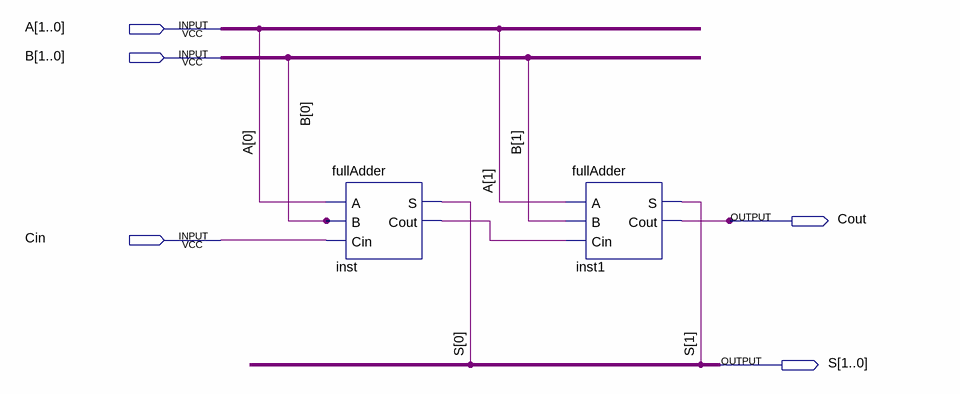
[diagram p0: schematic sheet]
// Quartus schematic 2bitAdder.bdf as structural Verilog: 2 symbols, 5 pins
module \2bitAdder  (
  input  [1:0] A,
  input  [1:0] B,
  input  Cin,
  output Cout,
  output [1:0] S
);

  wire inst_cout;

  fullAdder inst (.A(A[0]), .B(B[0]), .Cin(Cin), .S(S[0]), .Cout(inst_cout));
  fullAdder inst1 (.A(A[1]), .B(B[1]), .Cin(inst_cout), .S(S[1]), .Cout(Cout));
endmodule
